# EAGLE design ig-normal2ver2 (EAGLE 9.6.2)
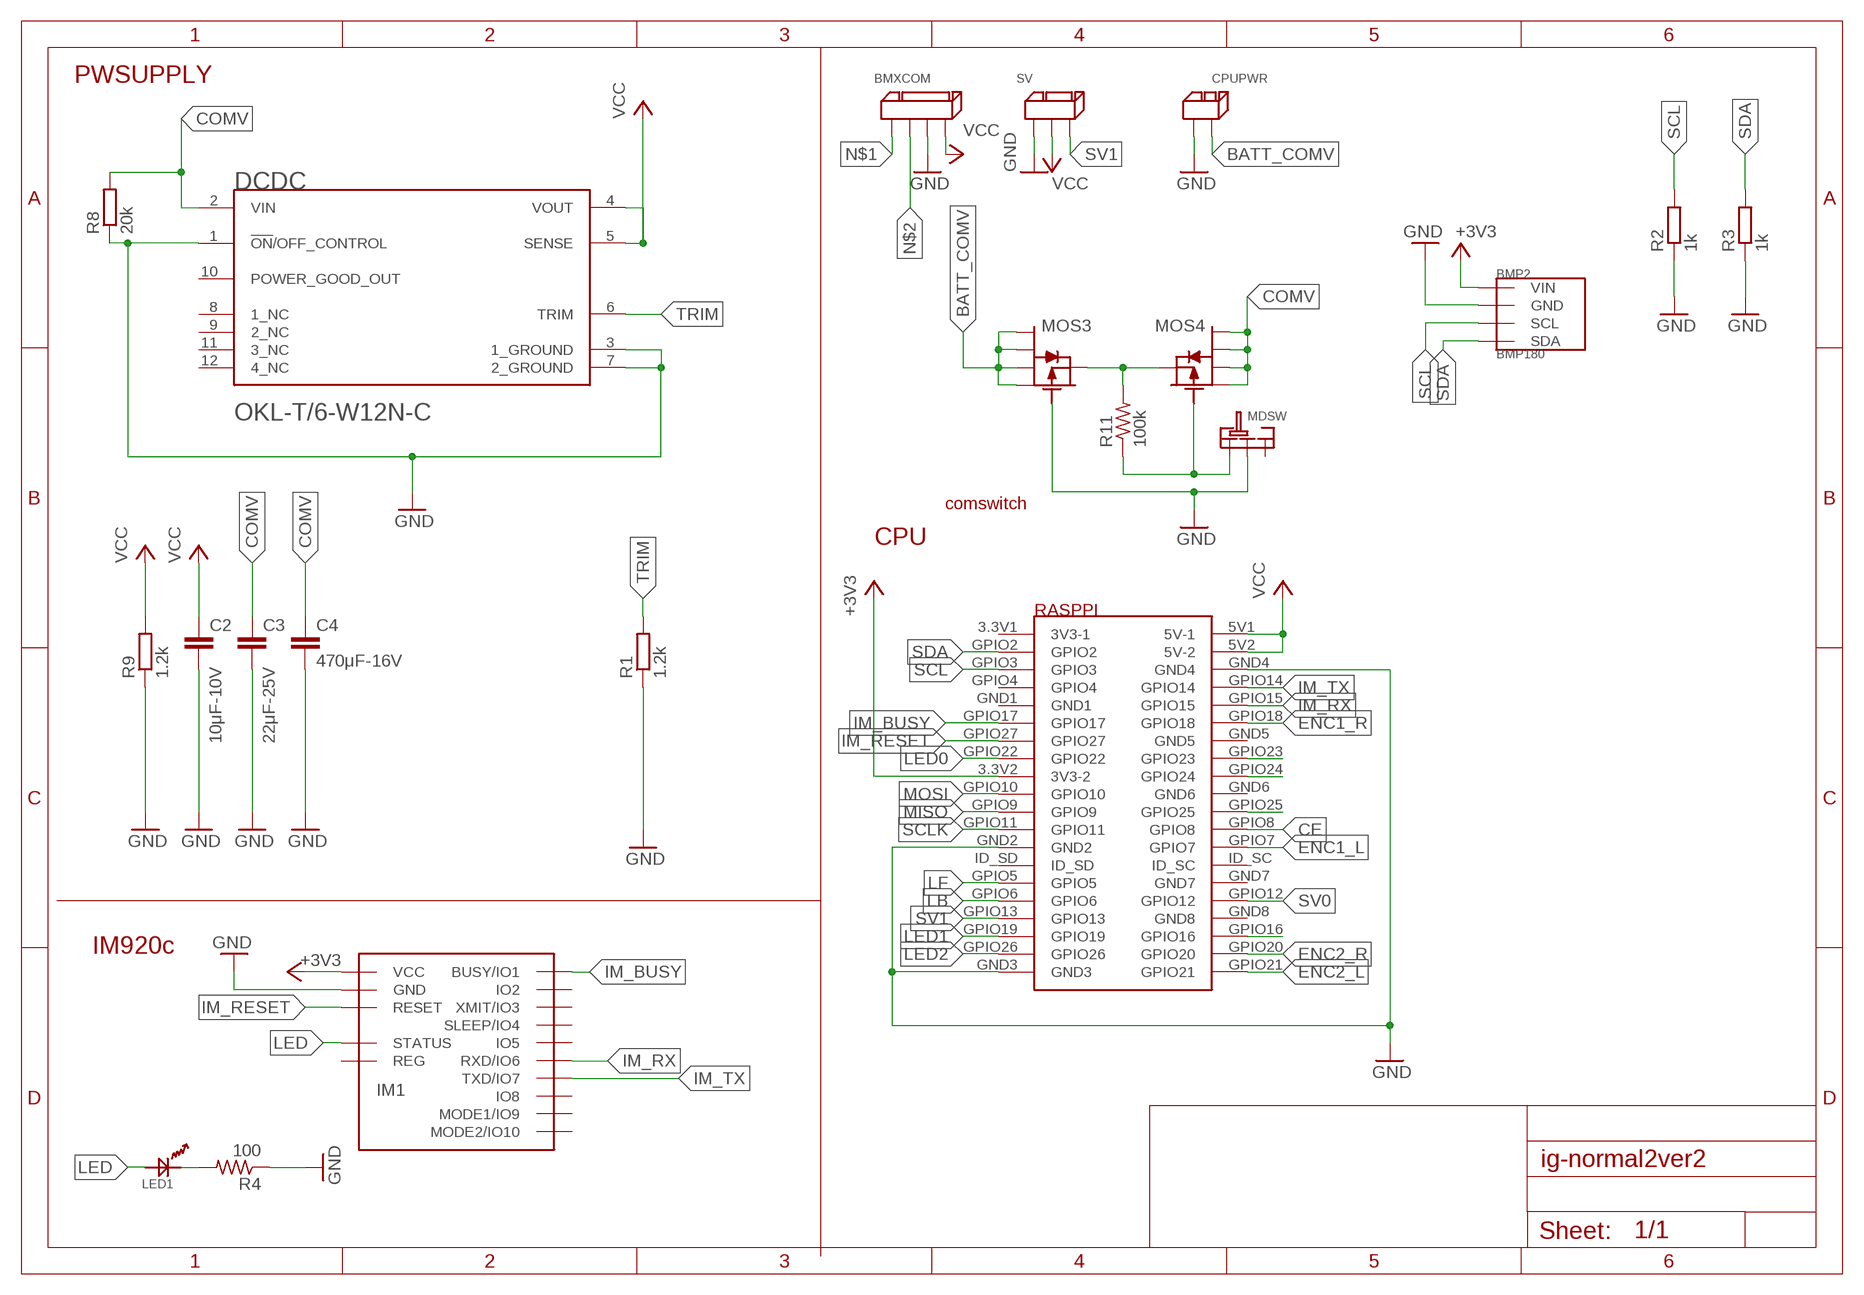
[diagram p0: schematic, sheet 1]

## Parts
BMP2  BMP180  [GY-68]
BMXCOM  4PIN  [4PIN]
C2  10μF-10V  C-EUC0603  [C0603]
C3  22μF-25V  C-EUC0603  [C0603]
C4  470μF-16V  C-EUC0603  [C0603]
CPUPWR  2PIN  [2PIN]
DCDC  OKL-T/6-W12N-CMURATA_OKL-T-6-W12N-C_0_0  [MURATA_OKL-T-6-W12N-C_0]
IM1  IM920_IM920C  [IM920_IM920C]
LED1  OSXX1608C1A  [OSXX1608C1A]
MDSW  SRIDE_SWITCH  [SRIDE_SWITCH]
MOS3  PCH_SSM6J808R  [SSM6J808R]
MOS4  PCH_SSM6J808R  [SSM6J808R]
R1  1.2k  R-EU_R0805  [R0805]
R2  1k  R-EU_R0603  [R0603]
R3  1k  R-EU_R0603  [R0603]
R4  100  R-US_R0603  [R0603]
R8  20k  R-EU_R0603  [R0603]
R9  1.2k  R-EU_R0805  [R0805]
R11  100k  R-US_R0603  [R0603]
RASPPI  RASPBERYPIZEROW  [RASPBERYPIZEROW]
SV  3PIN  [3PIN]

## Nets
+3V3 [PWR]: BMP2.P1(VIN) IM1.$P17(VCC) RASPPI.3.3V2(3V3-2)
BATT_COMV [PWR]: CPUPWR.P$2 MOS3.1 MOS3.2 MOS3.5 MOS3.6
CE: RASPPI.GPIO8
COMV [PWR]: C3.1 C4.1 DCDC.2(VIN) MOS4.1 MOS4.2 MOS4.5 MOS4.6 R8.2
ENC1_L: RASPPI.GPIO7
ENC1_R: RASPPI.GPIO18
ENC2_L: RASPPI.GPIO21
ENC2_R: RASPPI.GPIO20
GND [PWR]: BMP2.P2(GND) BMXCOM.P$3 C2.2 C3.2 C4.2 CPUPWR.P$1 DCDC.1(!ON!/OFF_CONTROL) DCDC.3(1_GROUND) DCDC.7(2_GROUND) IM1.$P18(GND) MDSW.LR MOS3.3 R1.1 R2.1 R3.1 R4.1 R8.1 R9.1 RASPPI.GND2 RASPPI.GND3 RASPPI.GND4 SV.P$1
IM_BUSY: IM1.$P1(BUSY/IO1) RASPPI.GPIO17
IM_RESET: IM1.$P19(RESET) RASPPI.GPIO27
IM_RX: IM1.$P6(RXD/IO6) RASPPI.GPIO15
IM_TX: IM1.$P7(TXD/IO7) RASPPI.GPIO14
LB: RASPPI.GPIO6
LB1: RASPPI.GPIO16
LED: IM1.$P15(STATUS) LED1.AN
LED0: RASPPI.GPIO22
LED1: RASPPI.GPIO19
LED2: RASPPI.GPIO26
LF: RASPPI.GPIO5
LF1: RASPPI.GPIO25
MISO: RASPPI.GPIO9
MOSI: RASPPI.GPIO10
N$1: BMXCOM.P$1
N$2: BMXCOM.P$2
N$3: LED1.CT R4.2
N$9 [mospwr]: MOS3.4 MOS4.4 R11.2
N$10 [mospwr]: MDSW.L MOS4.3 R11.1
RB1: RASPPI.GPIO24
RF1: RASPPI.GPIO23
SCL: BMP2.P3(SCL) R2.2 RASPPI.GPIO3
SCLK: RASPPI.GPIO11
SDA: BMP2.P4(SDA) R3.2 RASPPI.GPIO2
SV0: RASPPI.GPIO12
SV1: RASPPI.GPIO13 SV.P$3
TRIM: DCDC.6(TRIM) R1.2
VCC [PWR]: BMXCOM.P$4 C2.1 DCDC.4(VOUT) DCDC.5(SENSE) R9.2 RASPPI.5V1(5V-1) RASPPI.5V2(5V-2) SV.P$2
Unconnected: DCDC.8(1_NC) DCDC.9(2_NC) DCDC.10(POWER_GOOD_OUT) DCDC.11(3_NC) DCDC.12(4_NC) IM1.$P2(IO2) IM1.$P3(XMIT/IO3) IM1.$P4(SLEEP/IO4) IM1.$P5(IO5) IM1.$P8(IO8) IM1.$P9(MODE1/IO9) IM1.$P10(MODE2/IO10) IM1.$P16(REG) MDSW.R RASPPI.3.3V1(3V3-1) RASPPI.GND1 RASPPI.GND5 RASPPI.GND6 RASPPI.GND7 RASPPI.GND8 RASPPI.GPIO4 RASPPI.ID_SC RASPPI.ID_SD

## Notes on the sheet
- PWSUPPLY
- comswitch
- CPU
- IM920c

## Library data of the parts
BMP2 = BMP180:BMP180
BMXCOM = XR Connector:4PIN
C2-C4 = rcl:C-EU: CAPACITOR, European symbol; SPICEPREFIX: C
CPUPWR = XR Connector:2PIN
DCDC = OKL-T_6-W12N-C:OKL-T/6-W12N-C: Non-Isolated PoL Module DC DC Converter 1 Output 0.591 ~ 5.5V - - 6A 4.5V - 14V Input; AUTOMOTIVE: No; CENTROID_NOT_SPECIFIED: No; DATASHEET: https://www.murata.com/en-us/products/productdetail.aspx?partno=OKL-T/6-W12N-C; DEVICE_CLASS_L1: Integrated Circuits (ICs); DEVICE_CLASS_L2: Power Management ICs; DEVICE_CLASS_L3: Voltage Regulators - Switching; DIGIKEY_DESCRIPTION: DC DC CONVERTER 0.591-5.5V 30W; DIGIKEY_PART_NUMBER: 811-2214-1-ND; FOOTPRINT_VARIANT_NAME_0: Recommended_Land_Pattern; HEIGHT: 7.2mm; LEAD_FREE: Yes; MAX_SUPPLY_VOLTAGE: 14V; MF: Murata; MFG_PACKAGE_IDENT: OKL-T/6-W12; MFG_PACKAGE_IDENT_COMPONENT_ID: 4873da16363307f0; MFG_PACKAGE_IDENT_DATE: 0; MFG_PACKAGE_IDENT_REV: 0; MIN_SUPPLY_VOLTAGE: 4.5V; MOUSER_DESCRIPTION: Non-Isolated DC/DC Converters 12Vin .59-5.5Vout 6A 30W Neg Polarity; MOUSER_PART_NUMBER: 580-OKL-T/6-W12N-C; MPN: OKL-T/6-W12N-C; NOMINAL_SUPPLY_CURRENT: 20mA; NUMBER_OF_OUTPUTS: 1; OUTPUT_CURRENT: 6A; OUTPUT_TYPE: AdjustableProgrammable; OUTPUT_VOLTAGE: 0.591-5.5V; PACKAGE: iLGA12; PREFIX: MD; ROHS: Yes; SWITCHING_FREQUENCY: 600kHz; SWITCHING_TOPOLOGY: Buck; TEMPERATURE_RANGE_HIGH: +85°C; TEMPERATURE_RANGE_LOW: -40°C; VERIFICATION_VERSION: 0.0.0.3
IM1 = CANSAT12th:IM920_IM920C
LED1 = Chip LED:OSXX1608C1A
MDSW = Sride Switch:SRIDE_SWITCH
MOS3 MOS4 = Chip MOSFET:PCH_SSM6J808R
R1-R3 R8 R9 = rcl:R-EU_: RESISTOR, European symbol; SPICEPREFIX: R
R4 R11 = rcl:R-US_: RESISTOR, American symbol; SPICEPREFIX: R
RASPPI = RaspberyPiZeroW:RASPBERYPIZEROW
SV = XR Connector:3PIN

## Net classes
1 PWR: width 0.8 mm, clearance 0.1 mm
2 mospwr: width 0.45 mm

## Board
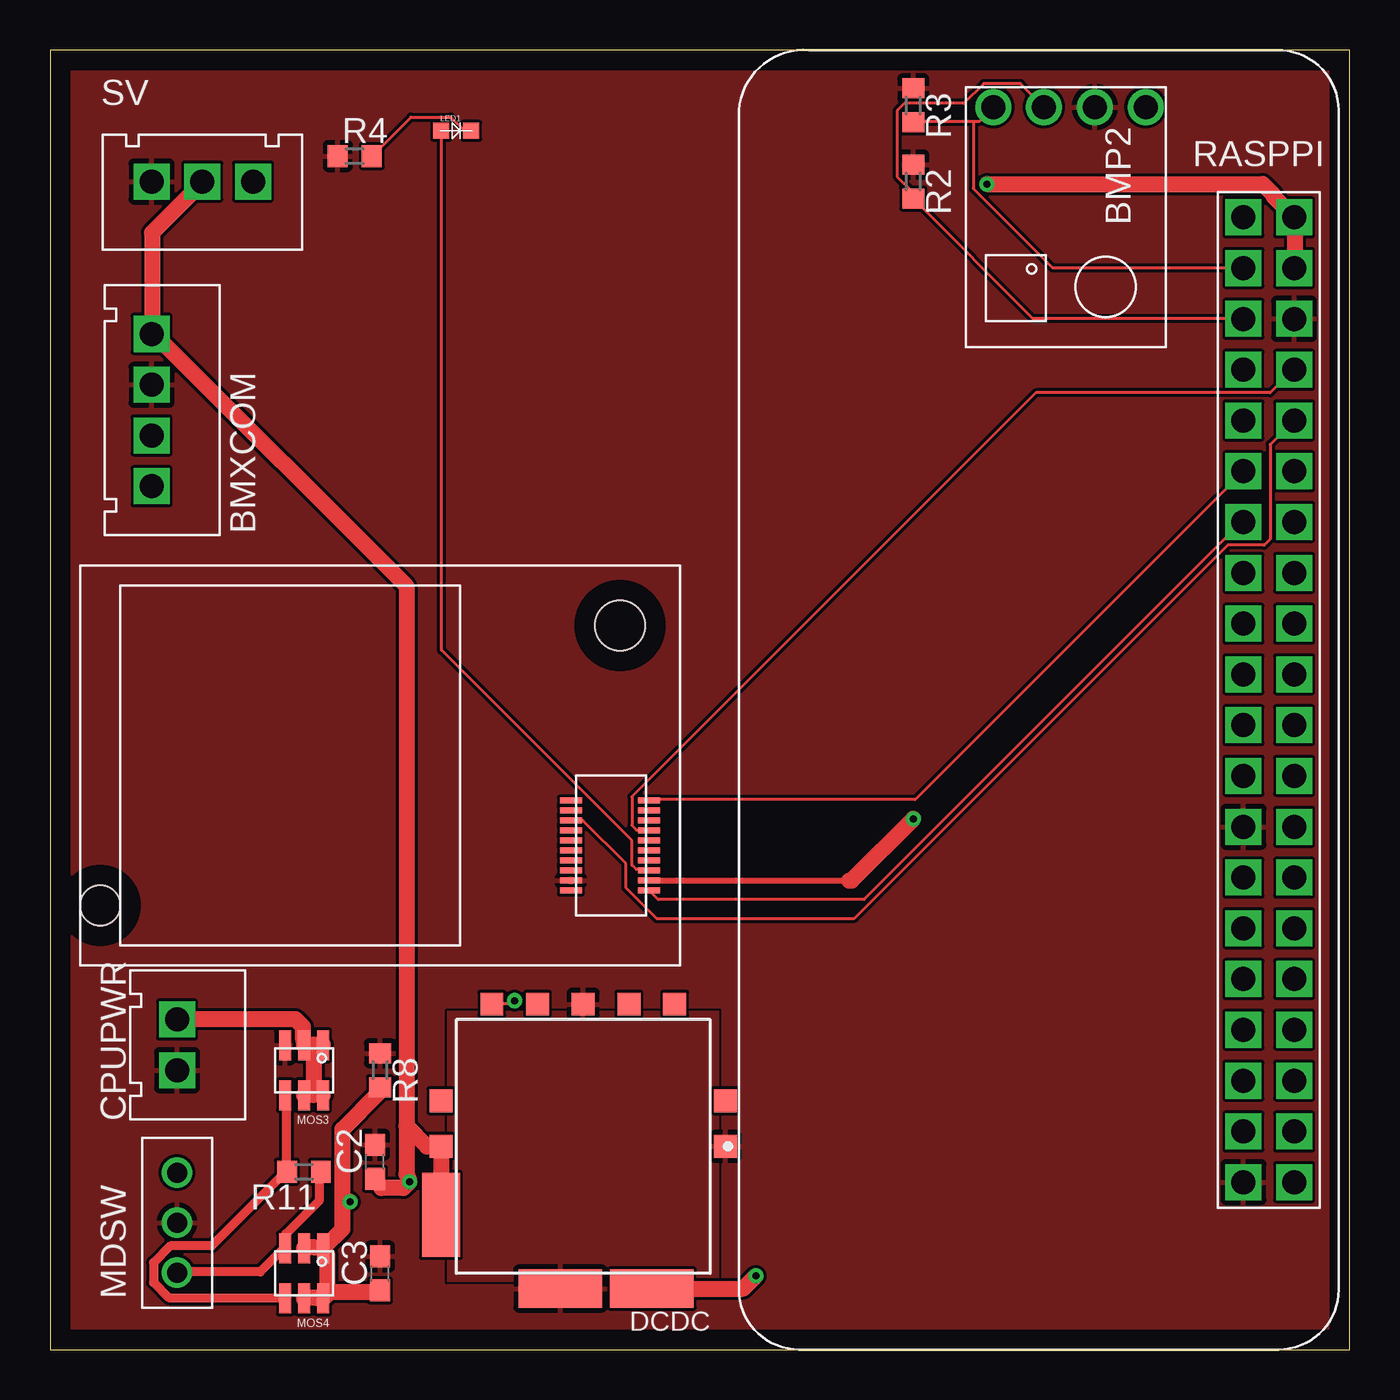
[diagram p1: board, top side]
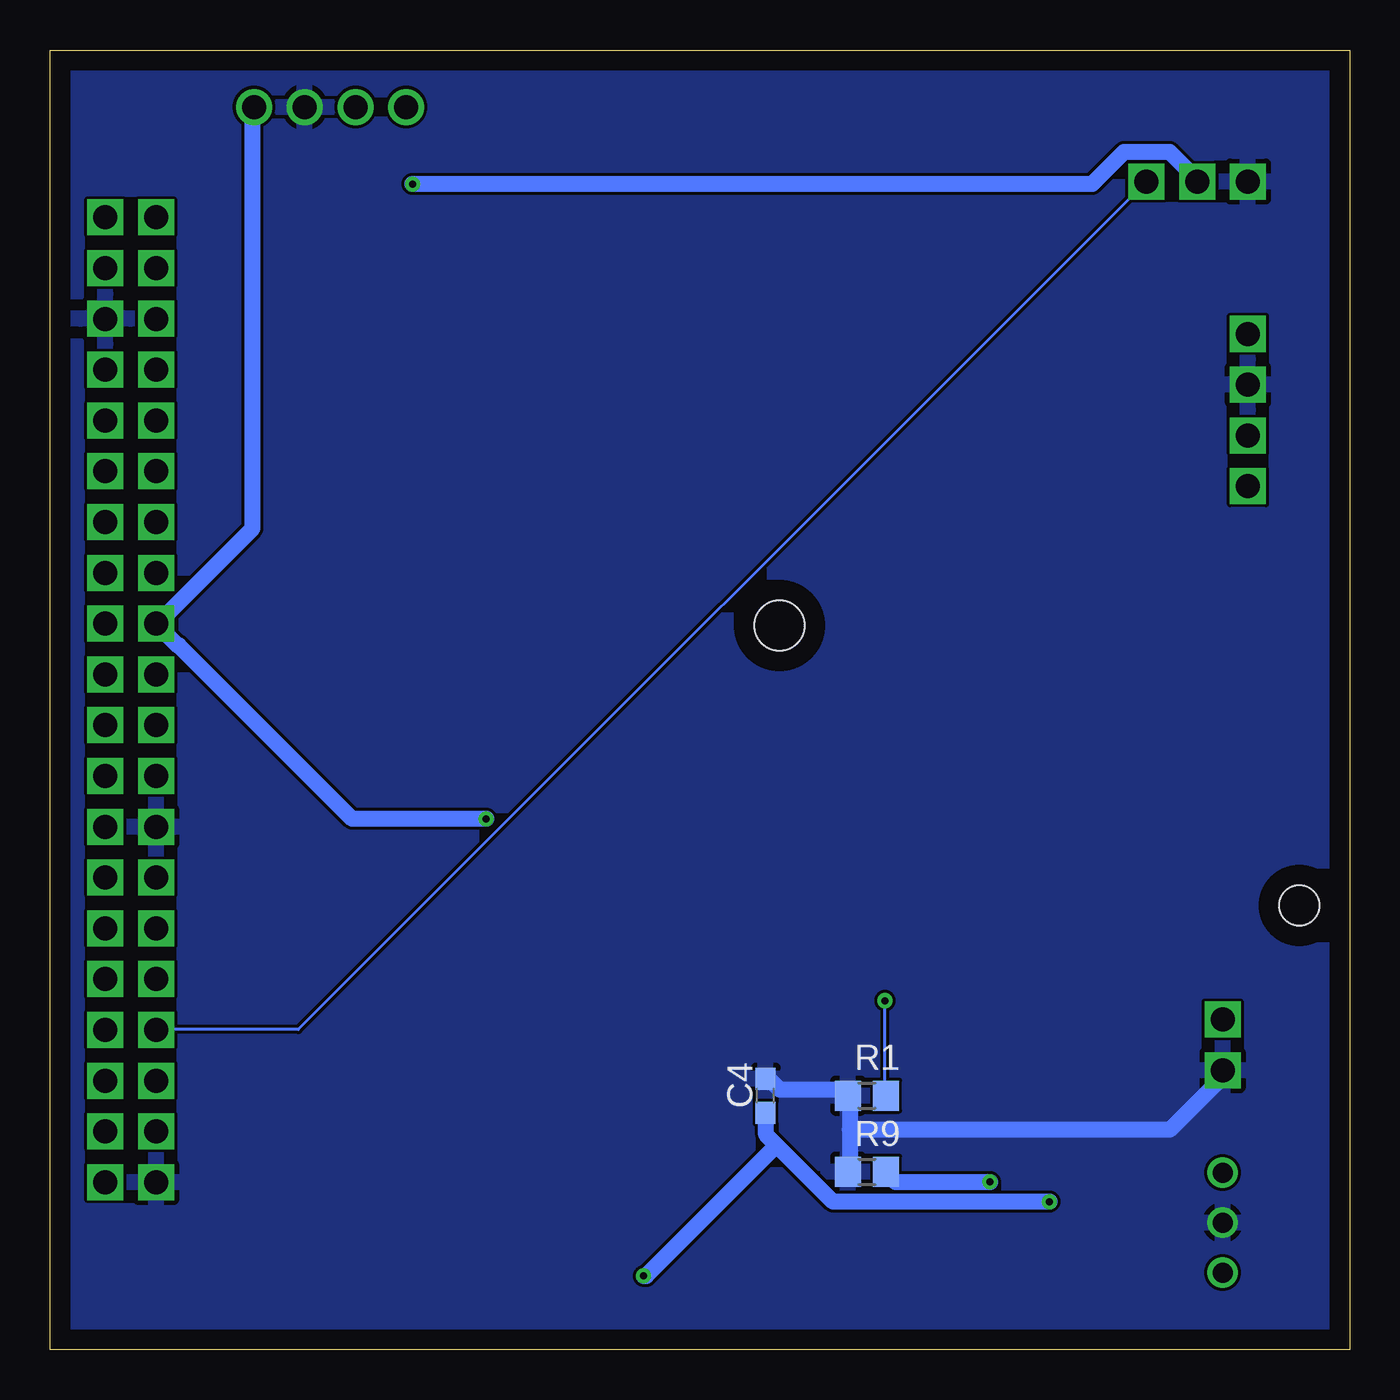
[diagram p2: board, bottom side, seen from below]

Size 65 x 65 mm. Coordinates in mm from the lower left corner, seen from the top.
Outline: 0,0 65,0 65,65 0,65 0,0
Copper layers (1*16): Top 0.035mm / dielectric 1.5mm / Bottom 0.035mm
Design rules "default": minimum track width 6mil, minimum drill 0.35mm, track to track 6mil, track to pad 6mil, pad to pad 6mil, via to via 6mil, smd to smd 6mil, copper to edge 40mil, drill to drill 6mil, minimum pad ring 10mil, minimum via ring 8mil, stop-mask expansion 4mil, vias tented up to drill 0mil, thermal gap 10mil

### Footprints (pad centres in the part's own frame; a part is rotated, then mirrored left to right if it is on the bottom)
GY-68 = drill 1.2: P1 -5,4; P2 -5,1.46; P3 -5,-1.08; P4 -5,-3.62
4PIN = drill 1.2 square: P$1 2.54,-2.54; P$2 5.08,-2.54; P$3 7.62,-2.54; P$4 10.16,-2.54
C0603 = smd 1.1 x 1: 1 -0.85,0; 2 0.85,0
2PIN = drill 1.2 square: P$1 -1.27,0; P$2 1.27,0
MURATA_OKL-T-6-W12N-C_0 = smd 1.143 x 1.143: 1 -7.112,0; 5 7.112,0; 6 4.572,-7.112; 7 0,-7.112; 8 -2.286,-7.112; 9 -4.572,-7.112; 10 -7.112,-2.286; 11 7.112,-2.286; 12 2.286,-7.112 | smd 4.191 x 1.905: 2 -3.429,7.112; 3 1.143,7.112 | smd 1.905 x 4.191: 4 7.112,3.429
IM920_IM920C = smd 0.3 x 1.1: $P1 -1.75,-13.45; $P2 -1.75,-9.55; $P3 -2.25,-13.45; $P4 -2.25,-9.55; $P5 -2.75,-13.45; $P6 -2.75,-9.55; $P7 -3.25,-13.45; $P8 -3.25,-9.55; $P9 -3.75,-13.45; $P10 -3.75,-9.55; $P11 -4.25,-13.45; $P12 -4.25,-9.55; $P13 -4.75,-13.45; $P14 -4.75,-9.55; $P15 -5.25,-13.45; $P16 -5.25,-9.55; $P17 -5.75,-13.45; $P18 -5.75,-9.55; $P19 -6.25,-13.45; $P20 -6.25,-9.55 | hole 2.5: 7,-12 | hole 2: -7,14
OSXX1608C1A = smd 0.8 x 0.8: AN -0.75,0; CT 0.75,0
SRIDE_SWITCH = drill 1: L -2.5,0; LR 0,0; R 2.5,0
SSM6J808R = smd 0.6 x 1.5: 1 -0.95,-1.25; 2 0,-1.25; 3 0.95,-1.25; 4 0.95,1.25; 5 0,1.25; 6 -0.95,1.25
R0805 = smd 1.3 x 1.5: 1 -0.95,0; 2 0.95,0
R0603 = smd 1 x 1.1: 1 -0.85,0; 2 0.85,0
RASPBERYPIZEROW = drill 1.2 pad 1.676 square: 3.3V1 -1.27,24.13; 3.3V2 -1.27,3.81; 5V1 1.27,24.13; 5V2 1.27,21.59; GND1 -1.27,13.97; GND2 -1.27,-6.35; GND3 -1.27,-24.13; GND4 1.27,19.05; GND5 1.27,8.89; GND6 1.27,1.27; GND7 1.27,-11.43; GND8 1.27,-16.51; GPIO2 -1.27,21.59; GPIO3 -1.27,19.05; GPIO4 -1.27,16.51; GPIO5 -1.27,-11.43; GPIO6 -1.27,-13.97; GPIO7 1.27,-6.35; GPIO8 1.27,-3.81; GPIO9 -1.27,-1.27; GPIO10 -1.27,1.27; GPIO11 -1.27,-3.81; GPIO12 1.27,-13.97; GPIO13 -1.27,-16.51; GPIO14 1.27,16.51; GPIO15 1.27,13.97; GPIO16 1.27,-19.05; GPIO17 -1.27,11.43; GPIO18 1.27,11.43; GPIO19 -1.27,-19.05; GPIO20 1.27,-21.59; GPIO21 1.27,-24.13; GPIO22 -1.27,6.35; GPIO23 1.27,6.35; GPIO24 1.27,3.81; GPIO25 1.27,-1.27; GPIO26 -1.27,-21.59; GPIO27 -1.27,8.89; ID_SC 1.27,-8.89; ID_SD -1.27,-8.89
3PIN = drill 1.2 square: P$1 2.54,-2.54; P$2 5.08,-2.54; P$3 7.62,-2.54

### Placement (x,y rotation side)
BMP2  50.8,57.15 270 top
BMXCOM  2.54,40.64 90 top
C2  16.26,9.4 90 top
C3  16.51,3.81 90 top
C4  29.21,12.7 90 bottom
CPUPWR  6.35,15.24 90 top
DCDC  26.67,10.16 180 top
IM1  16.51,29.21 90 top
LED1  20.32,60.96 0 top
MDSW  6.35,6.35 90 top
MOS3  12.7,13.97 180 top
MOS4  12.7,3.81 180 top
R1  24.13,12.7 0 bottom
R2  43.18,58.42 270 top
R3  43.18,62.23 270 top
R4  15.24,59.69 0 top
R8  16.51,13.97 270 top
R9  24.13,8.89 0 bottom
R11  12.7,8.89 180 top
RASPPI  60.96,32.5 0 top
SV  2.54,60.96 0 top

### Tracks (layer width: path | path; a pad name or v marks a point on that pad's centre or on a via)
+3V3  (via drill 0.35)
  Top 0.305: IM1.$P17 39.97,23.46
  Top 0.8: 39.97,23.46 40.1,23.46 v43.18,26.54
  Bottom 0.8: 59.66,36.27 54.86,41.07 54.86,62.1 BMP2.P1 | 59.66,36.27 RASPPI.3.3V2 | 59.66,36.27 58.62,35.22 58.56,35.22 49.88,26.54 v43.18,26.54
BATT_COMV
  Top 0.8: 13.18,12.72 MOS3.6 | 13.18,12.72 12.72,12.72 MOS3.5 | 13.18,15.24 13.64,15.24 MOS3.1 | 13.18,15.24 12.72,15.24 MOS3.2 12.65,15.62 12.65,16.15 12.27,16.54 6.4,16.54 CPUPWR.P$2 | 13.18,15.24 13.18,12.72
COMV  (via drill 0.35)
  Top 0.8: C3.1 16.46,2.9 14.02,2.9 13.72,2.59 MOS4.6 | MOS4.5 12.72,2.59 13.26,2.59 MOS4.6 | 14.63,7.39 14.63,6.02 13.72,5.11 MOS4.1 | 14.63,7.39 14.63,11.02 16.46,12.85 16.46,13.11 R8.2 | v15.01,7.39 14.63,7.39 | MOS4.2 12.72,5.11 13.26,5.11 MOS4.1 | MOS4.6 13.87,3.28 13.87,4.72 MOS4.1 | DCDC.2 34.67,3.05 v35.31,3.68
  Bottom 0.8: 28.65,10.21 25.83,7.39 v15.01,7.39 | 28.65,10.21 29.18,10.74 29.18,11.81 C4.1 | v35.31,3.68 35.18,3.68 28.65,10.21
GND
  Bottom 0.8: C4.2 29,13.5 28.5,13 25.5,13 R1.1 25,12.5 25,11 | 25,11 25,9 R9.1 | 25,11 9,11 6.5,13.5 CPUPWR.P$1
  pour Top: -1.27,-1.27 66.04,-1.27 67.31,0 67.31,68.58 -3.81,68.58 -3.81,-1.27
  pour Bottom: -4.06,68.45 67.31,68.45 67.44,68.33 67.44,0.25 67.44,0.13 65.91,-1.4 -3.94,-1.4 -3.94,66.67 -4.7,67.44 -4.7,67.94 -4.19,68.45
IM_BUSY
  Top 0.152: IM1.$P1 30.02,27.51 43.28,27.51 59.66,43.89 RASPPI.GPIO17
IM_RESET
  Top 0.152: IM1.$P19 30.42,22.5 40.72,22.5 59.66,41.45 RASPPI.GPIO27
IM_RX
  Top 0.152: IM1.$P6 26.06,26.44 26.67,26.44 28.8,24.31 28.8,23.09 30.35,21.54 40.21,21.54 58.9,40.23 60.73,40.23 61.04,40.54 61.04,45.26 62.18,46.41 RASPPI.GPIO15
IM_TX
  Top 0.152: IM1.$P7 29.95,25.98 29.34,25.98 29.11,26.21 29.11,27.66 49.3,47.85 61.04,47.85 62.18,49 RASPPI.GPIO14
LED
  Top 0.152: LED1.AN 19.58,60.96 19.58,34.98 29.11,25.45 29.11,24.23 29.34,24 29.95,24 IM1.$P15
N$3
  Top 0.152: LED1.CT 20.73,60.96 20.04,61.65 18.06,61.65 16.15,59.74 R4.2
N$9
  Top 0.45: MOS3.4 11.81,12.65 11.81,8.91 R11.2 11.66,8.76 8.08,5.18 6.02,5.18 5.18,4.34 5.18,3.35 5.94,2.59 11.73,2.59 MOS4.4
N$10
  Top 0.45: R11.1 13.49,8.84 13.49,7.47 11.81,5.79 11.81,5.11 MOS4.3 11.58,4.95 10.52,3.89 6.4,3.89 MDSW.L
SCL
  Top 0.152: BMP2.P3 49.68,62.18 48.54,63.32 46.71,63.32 45.72,62.33 42.75,62.33 42.37,61.95 42.37,58.67 43.13,57.91 43.13,57.61 R2.2 43.2,57.53 49.15,51.59 59.66,51.59 RASPPI.GPIO3
SDA
  Top 0.152: 46.18,61.42 46.48,61.42 47.17,62.1 BMP2.P4 | 46.18,61.42 43.2,61.42 R3.2 | 46.18,61.42 46.18,58.06 50.14,54.1 59.66,54.1 RASPPI.GPIO2
SV1
  Bottom 0.152: SV.P$3 52.58,16 59.66,16 RASPPI.GPIO13
TRIM  (via drill 0.35)
  Top 0.152: v23.24,17.45 23.09,17.3 22.1,17.3 DCDC.6
  Bottom 0.152: v23.24,17.45 23.24,12.72 R1.2
VCC  (via drill 0.35)
  Top 0.8: RASPPI.5V2 62.26,54.1 62.26,56.62 RASPPI.5V1 61.95,56.92 61.19,57.68 61.19,57.76 60.66,58.29 v46.86,58.29 | C2.1 16.58,8.08 17.68,8.08 v17.98,8.38 17.83,8.76 17.83,11.18 | SV.P$2 7.62,58.37 5.11,55.85 5.11,50.83 BMXCOM.P$4 5.41,50.6 17.83,38.18 17.83,11.18 | DCDC.4 DCDC.5 18.85,10.16 17.83,11.18
  Bottom 0.8: v17.98,8.38 22.71,8.38 23.16,8.84 R9.2 | v46.86,58.29 12.88,58.29 11.28,59.89 8.99,59.89 7.62,58.52 SV.P$2